# EasyEDA schematic SCH_proyecto-mme_Antonio-Martinez_2025-03-06.json
TITLE: Hub USB; REV: 1.0; Date: 2025-02-21; Sheet: 1/1; Drawn By: amartinez20961; Company: IES Joan Ramis i Ramis
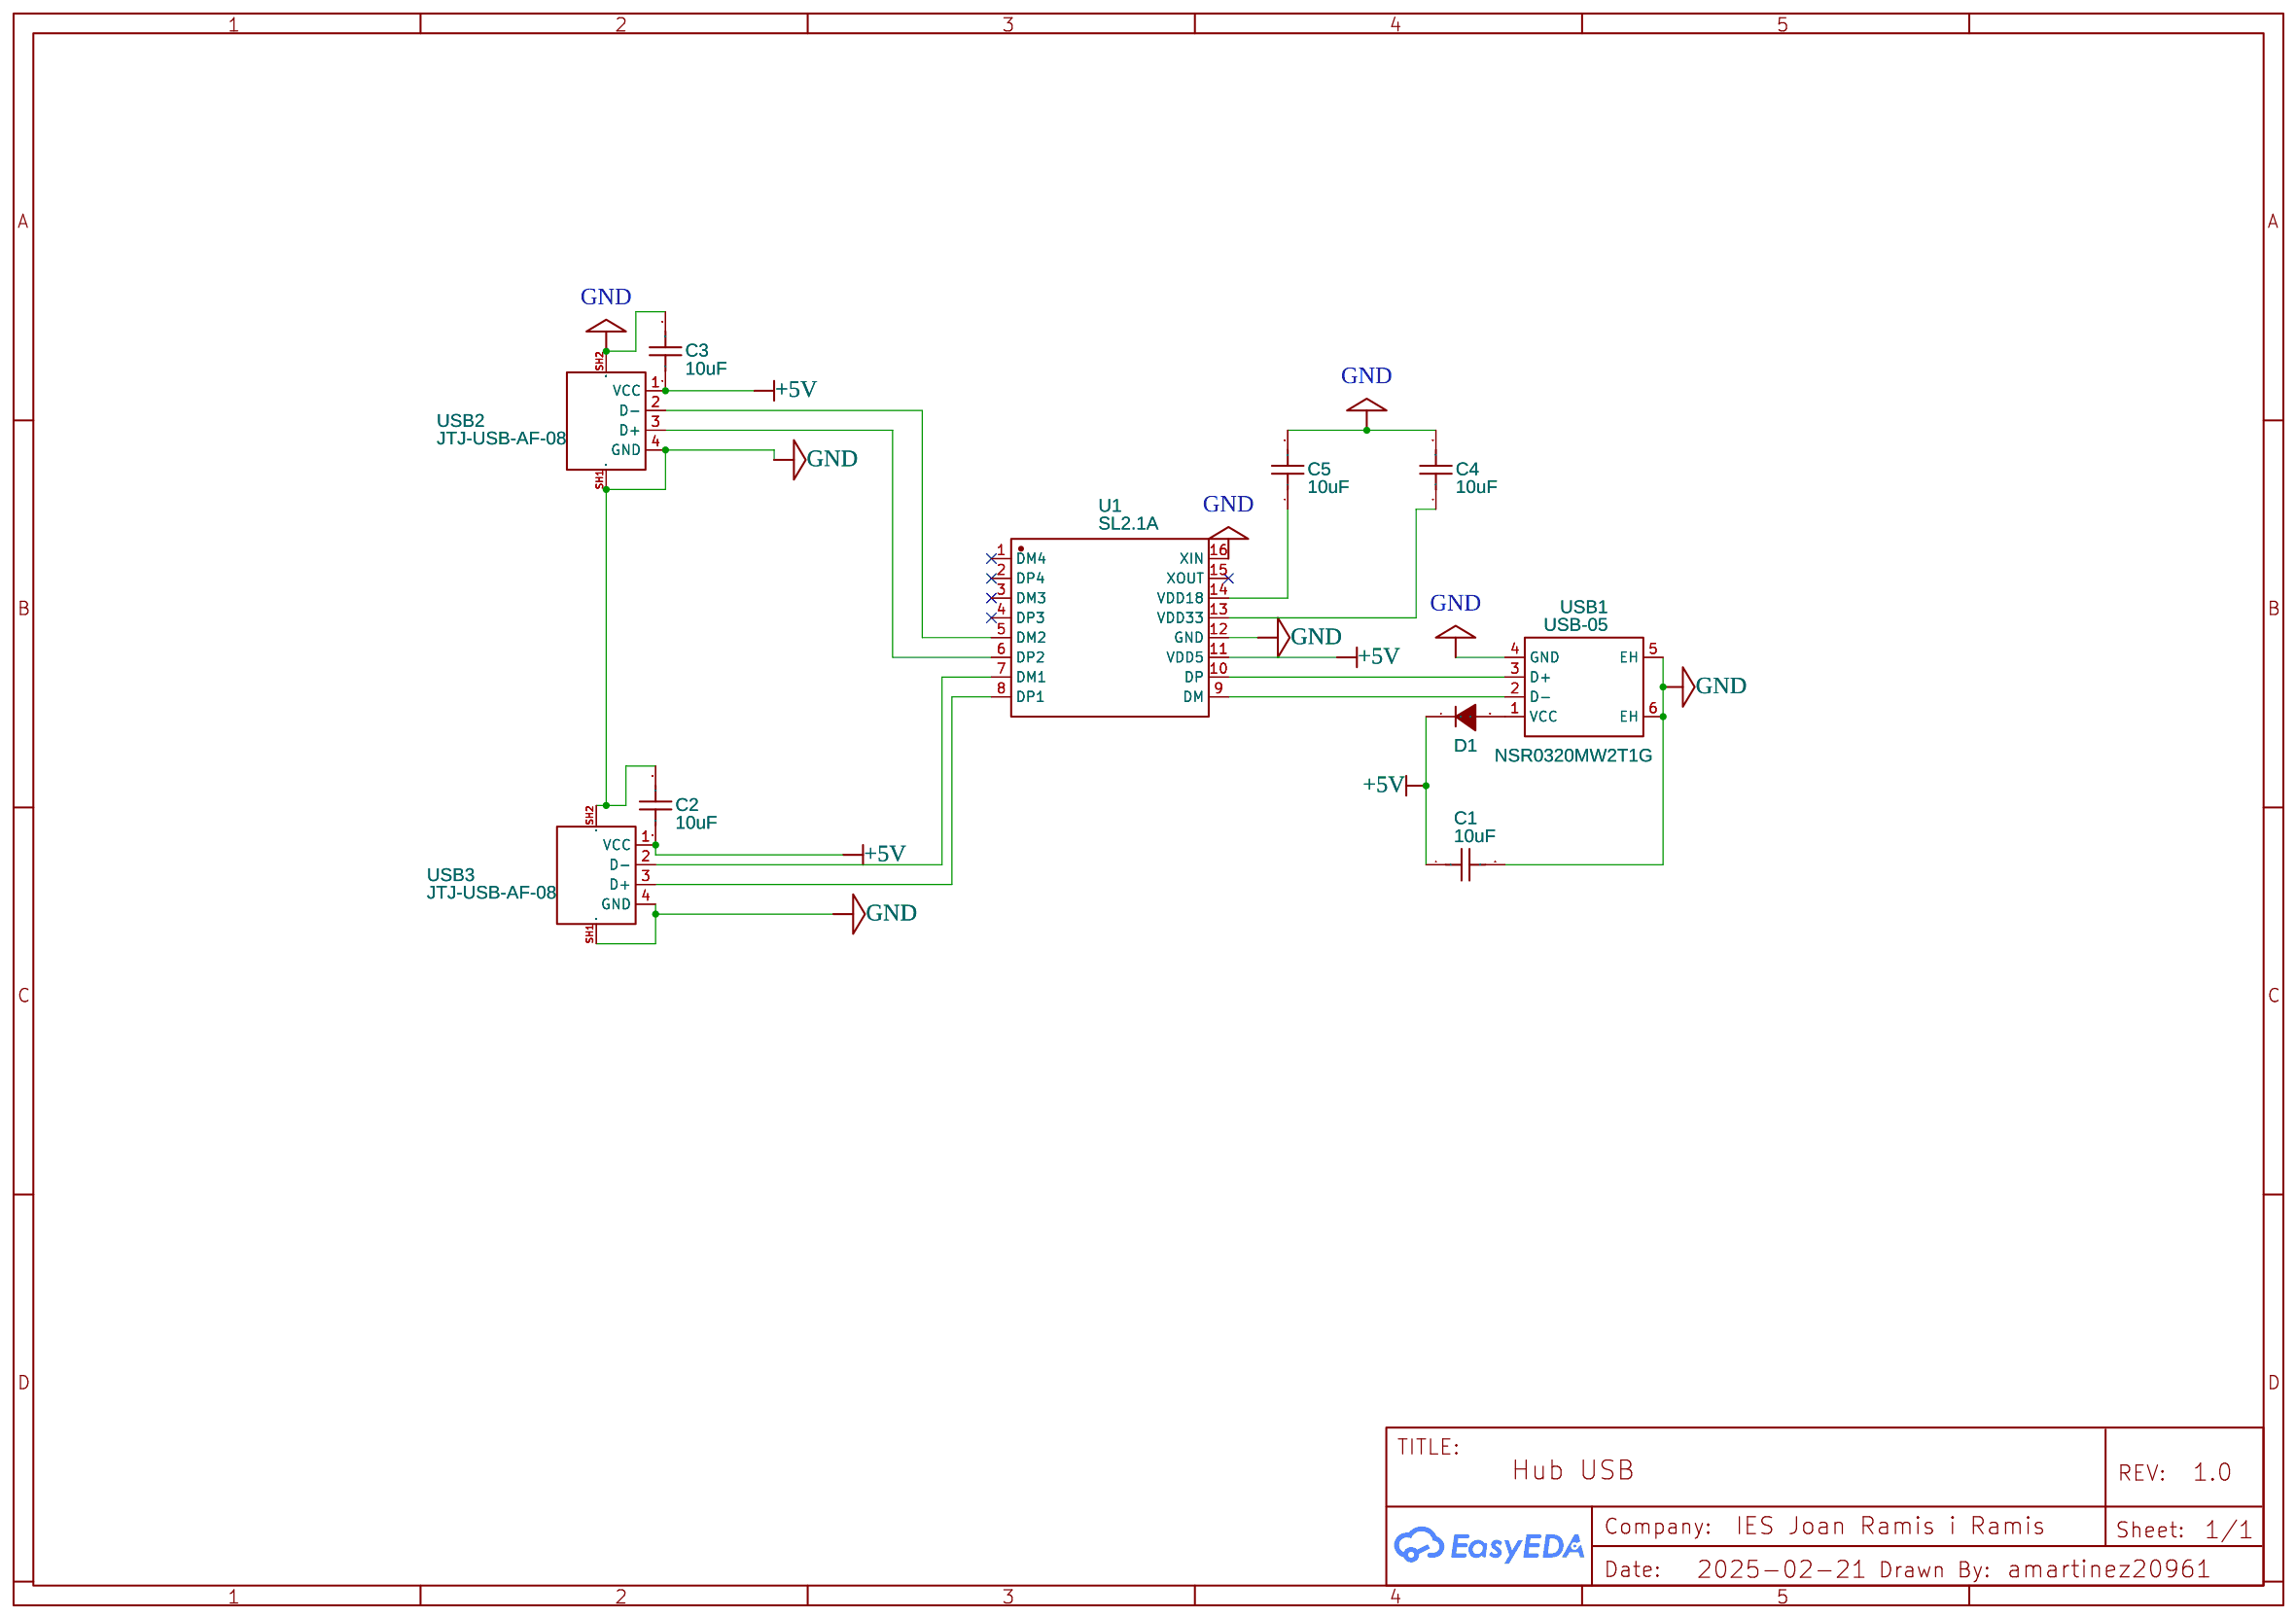
[diagram p0: schematic sheet]

## Parts
C1  10uF  [C0603]
C2  10uF  [C0603]
C3  10uF  [C0603]
C4  10uF  [C0603]
C5  10uF  [C0603]
D1  NSR0320MW2T1G  [SOD-323_L1.8-W1.3-LS2.5-RD]
U1  SL2.1A  [SOP-16_L10.0-W3.9-P1.27-LS6.0-BL]
USB1  USB-05  [USB-A-TH_USB-05]
USB2  JTJ-USB-AF-08  [USB-A-TH__USB-AF-90]
USB3  JTJ-USB-AF-08  [USB-A-TH__USB-AF-90]

## Library data of the parts
C1-C5 = CL10A106KP8NNNC: Supplier: LCSC; Manufacturer: SAMSUNG(三星); Supplier Part: C19702; JLCPCB Part Class: Basic Part
D1 = NSR0320MW2T1G: Supplier: LCSC; Manufacturer: onsemi(安森美); Supplier Part: C48192; JLCPCB Part Class: Extended Part
U1 = SL2.1A: Contributor: LCSC; Supplier: LCSC; Supplier Part: C192893; Manufacturer: CoreChips(和芯润德); JLCPCB Part Class: Extended Part
USB1 = USB-05: Contributor: LCSC; Supplier: LCSC; Manufacturer: SOFNG(硕方); Supplier Part: C112454; JLCPCB Part Class: Extended Part
USB2 = JTJ-USB-AF-08: Contributor: LCSC; Supplier: LCSC; Manufacturer Part: 902-131A1011D10100; Supplier Part: C2345; JLCPCB Part Class: Extended Part; Manufacturer: 精拓金
USB3 = JTJ-USB-AF-08: Contributor: LCSC; Supplier: LCSC; Manufacturer Part: 902-131A1011D10100; Supplier Part: C2345; JLCPCB Part Class: Extended Part; Manufacturer: 精拓金; link: https://lcsc.com/eda_search?q=C2345&%26type=1&ref=editor

## Nets
+5V: C1.1 C2.1 C3.1 D1.1(C) U1.11(VDD5) USB2.1(VCC) USB3.1(VCC)
GND: C1.2 C2.2 C3.2 C4.2 C5.2 U1.12(GND) U1.16(XIN) USB1.4(GND) USB1.5(EH) USB1.6(EH) USB2.4(GND) USB2.SH1 USB2.SH2 USB3.4(GND) USB3.SH1 USB3.SH2
Net-(C4-1): C4.1 U1.13(VDD33)
Net-(C5-1): C5.1 U1.14(VDD18)
Net-(D1-2): D1.2(A) USB1.1(VCC)
Net-(U1-5): U1.5(DM2) USB2.2(D-)
Net-(U1-6): U1.6(DP2) USB2.3(D+)
Net-(U1-7): U1.7(DM1) USB3.2(D-)
Net-(U1-8): U1.8(DP1) USB3.3(D+)
Net-(U1-9): U1.9(DM) USB1.2(D-)
Net-(U1-10): U1.10(DP) USB1.3(D+)

Not connected (* = marked no-connect by the designer): U1 1(DM4)* 2(DP4)* 3(DM3)* 4(DP3)* 15(XOUT)*
